# Altium schematic sheet Laser_current_board.SchDoc
size A4
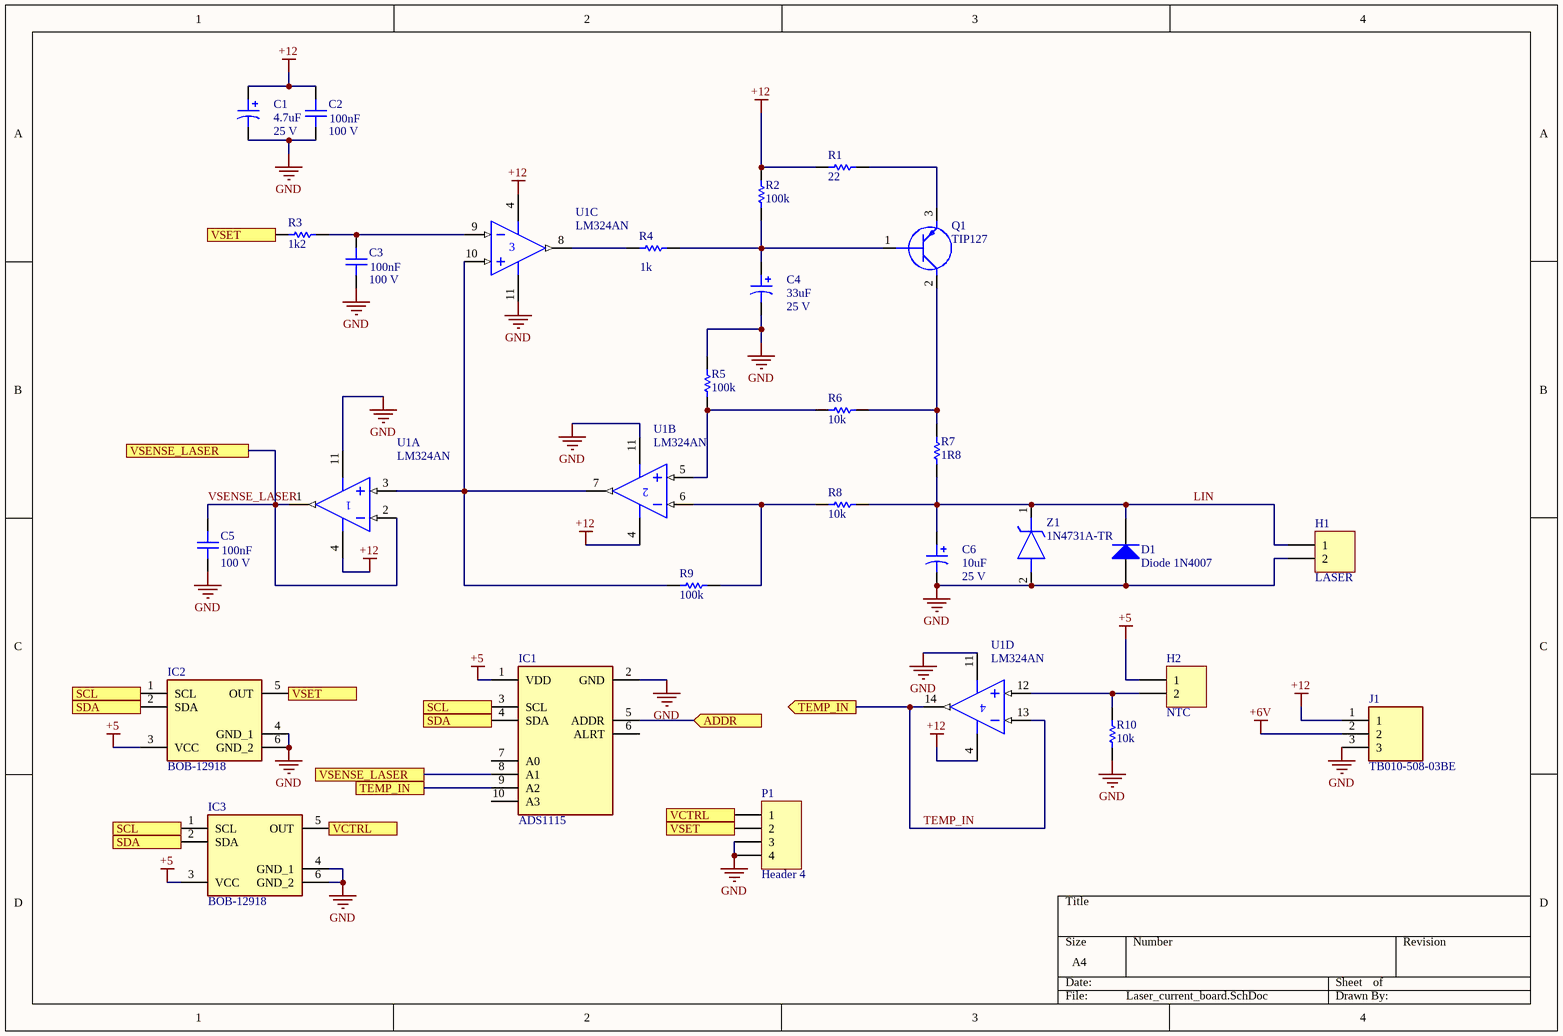
[diagram p0: Laser_current_board.SchDoc]

## Parts
C1  value 4.7uF  Voltage: 25 V  [CP-5.0mm-11.0mm-2.0mm]  (hidden comment: CapacitorPol)
C2  value 100nF  Voltage: 100 V  [C100-200-100]  (hidden comment: Capacitor)
C3  value 100nF  Voltage: 100 V  [C100-200-100]  (hidden comment: Capacitor)
C4  value 33uF  Voltage: 25 V  [CP-5.0mm-11.0mm-2.0mm]  (hidden comment: CapacitorPol)
C5  value 100nF  Voltage: 100 V  [C100-200-100]  (hidden comment: Capacitor)
C6  value 10uF  Voltage: 25 V  [CP-5.0mm-11.0mm-2.0mm]  (hidden comment: CapacitorPol)
D1  Diode 1N4007  [DO-41]
H1  LASER  [TB02]
H2  NTC  [TB02]
IC1  ADS1115  [ADS1115]
IC2  BOB-12918  [BOB12918]
IC3  BOB-12918  [BOB12918]
J1  TB010-508-03BE  [TB01050803BE]
P1  Header 4  [HDR1X4]
Q1  TIP127  [TO254P483X1010X2035-3P]
R1  value 22  [R400-2.0mm]  (hidden comment: Resistor)
R2  value 100k  [R400-2.0mm]  (hidden comment: Resistor)
R3  value 1k2  [R400-2.0mm]  (hidden comment: Resistor)
R4  value 1k  [R400-2.0mm]  (hidden comment: Resistor)
R5  value 100k  [R400-2.0mm]  (hidden comment: Resistor)
R6  value 10k  [R400-2.0mm]  (hidden comment: Resistor)
R7  value 1R8  [R400-2.0mm]  (hidden comment: Resistor)
R8  value 10k  [R400-2.0mm]  (hidden comment: Resistor)
R9  value 100k  [R400-2.0mm]  (hidden comment: Resistor)
R10  value 10k  [R400-2.0mm]  (hidden comment: Resistor)
U1  LM324AN  [N014]  (parts A,B,C,D of 4)
Z1  1N4731A-TR  [DIOAD1310W86L370D235]

## Ports
ADDR (in), SCL, SCL (in), SDA, SDA (in), TEMP_IN, TEMP_IN (out), VCTRL, VSENSE_LASER, VSET

## Nets
+5: H2.1 IC1.1(VDD) IC2.3(VCC) IC3.3(VCC)
+6V: J1.2
+12: C1.1 C2.2 J1.1 R1.1 R2.1 U1.4(V+)
GND: C1.2 C2.1 C3.1 C4.2 C5.1 C6.2 D1.1(A) H1.2 IC1.2(GND) IC2.4(GND_1) IC2.6(GND_2) IC3.4(GND_1) IC3.6(GND_2) J1.3 P1.3 P1.4 R5.2 R10.1 U1.11(V-) Z1.2(A)
ADDR: IC1.5(ADDR) ; port ADDR
LIN: C6.1 D1.2(K) H1.1 R7.2 R8.2 Z1.1(K)
SCL: IC1.3(SCL) IC2.1(SCL) IC3.1(SCL) ; port SCL
SDA: IC1.4(SDA) IC2.2(SDA) IC3.2(SDA) ; port SDA
TEMP_IN: IC1.9(A2) U1.13(IN-) U1.14(OUT) ; port TEMP_IN
VCTRL: IC3.5(OUT) P1.1 ; port VCTRL
VSENSE_LASER: C5.2 IC1.8(A1) U1.1(OUT) U1.2(IN-) ; port VSENSE_LASER
VSET: IC2.5(OUT) P1.2 R3.2 ; port VSET
NetC3_2: C3.2 R3.1 U1.9(IN-)
NetC4_1: C4.1 Q1.1(B) R2.2 R4.1
NetH2_2: H2.2 R10.2 U1.12(IN+)
NetQ1_2: Q1.2(C) R6.2 R7.1
NetQ1_3: Q1.3(E) R1.2
NetR4_2: R4.2 U1.8(OUT)
NetR5_1: R5.1 R6.1 U1.5(IN+)
NetR8_1: R8.1 R9.2 U1.6(IN-)
NetR9_1: R9.1 U1.3(IN+) U1.7(OUT) U1.10(IN+)

Not connected (* = marked no-connect by the designer): IC1 6(ALRT) 7(A0) 10(A3)

## Library data of the parts
C1 C4 C6 = CapacitorPol: Solid Aluminum Capacitor with Organic Semiconductor Electrolyte: 100uF, 10V, Bulk Pack; Note: Part Numbers shown are for ± 20% capacitance tolerance (X0).; PCB_Layout: Complies with Manufacturer's Recommendation.; DrillSize: Nominal, Rounded to the nearest 0.1mm; Published: 19-Mar-2004; DatasheetDocument: 29-Jun-2001; PackageReference: E; Publisher: Altium Limited; ComponentLink1Description: Manufacturer Link; ComponentLink1URL: http://www.vishay.com/; ComponentLink2Description: Datasheet; ComponentLink2URL: http://www.vishay.com/docs/90003/94sa.pdf
D1 = Diode 1N4007: 1 Amp General Purpose Rectifier; Published: 8-Jun-2000; LatestRevisionDate: 17-Jul-2002; LatestRevisionNote: Re-released for DXP Platform.; DatasheetVersion: 1998; PackageVersion: Aug-1999; PackageReference: DO-41; Publisher: Altium Limited; PackageDescription: Diode, Axial; Body 5.2 x 2.7 mm (LxDia. max), Lead Dia. 0.86 mm (max); Code_JEDEC: DO-204-AL; ComponentLink1Description: Manufacturer Link; ComponentLink1URL: http://www.fairchildsemi.com/; ComponentLink2Description: Datasheet; ComponentLink2URL: http://www.fairchildsemi.com/ds/1N%2F1N4001.pdf
H1 H2 = Terminal_1x2: Bloco terminal 1x2
IC1 = ADS1115: Integrated Circuit; Manufacturer_Name: Adafruit; Datasheet Link: https://cdn-learn.adafruit.com/downloads/pdf/adafruit-4-channel-adc-breakouts.pdf; Height: 3.25mm; Manufacturer_Part_Number: ADS1115
IC2 IC3 = BOB-12918: Integrated Circuit; Manufacturer_Name: SparkFun; Datasheet Link: https://www.sparkfun.com/products/12918; Height: 2mm; Manufacturer_Part_Number: BOB-12918; Mouser Part Number: 474-BOB-12918; Mouser Price/Stock: https://www.mouser.co.uk/ProductDetail/SparkFun/BOB-12918?qs=WyAARYrbSnZElsWSnCaKMQ%3D%3D; Arrow Part Number: BOB-12918; Arrow Price/Stock: https://www.arrow.com/en/products/bob-12918/sparkfun-electronics?region=nac
J1 = TB010-508-03BE: Connector; Manufacturer_Name: CUI Inc.; Datasheet Link: https://componentsearchengine.com/Datasheets/1/TB010-508-03BE.pdf; Height: 18.2mm; Manufacturer_Part_Number: TB010-508-03BE; Mouser Part Number: 490-TB010-508-03BE; Mouser Price/Stock: https://www.mouser.co.uk/ProductDetail/CUI-Devices/TB010-508-03BE?qs=vLWxofP3U2z1pw1VuAsf2Q%3D%3D; Arrow Part Number: TB010-508-03BE; Arrow Price/Stock: https://www.arrow.com/en/products/tb010-508-03be/cui-devices?region=nac
P1 = Header 4: Header, 4-Pin; LatestRevisionDate: 17-Jul-2002; LatestRevisionNote: Re-released for DXP Platform.; Publisher: Altium Limited
Q1 = TIP127: Transistor BJT PNP; Manufacturer_Name: onsemi; Datasheet Link: http://www.onsemi.com/pub/Collateral/TIP120-D.PDF; Height: 4.83mm; Manufacturer_Part_Number: TIP127; Mouser Part Number: 512-TIP127; Mouser Price/Stock: https://www.mouser.co.uk/ProductDetail/ON-Semiconductor-Fairchild/TIP127?qs=ljbEvF4DwOMFP7NR%2F8L9Tw%3D%3D; Arrow Part Number: TIP127; Arrow Price/Stock: https://www.arrow.com/en/products/tip127/on-semiconductor
R1-R10 = Resistor: Power: 1/8 W; Tolerance: 5%; Published: 8-Jun-2000; LatestRevisionDate: 17-Jul-2002; LatestRevisionNote: Re-released for DXP Platform.; PackageReference: AXIAL-0.3; Publisher: Altium Limited
U1 = LM324AN: Quadruple Operational Amplifier; Published: 15-Apr-2002; LatestRevisionDate: 04-Mar-2005; LatestRevisionNote: Stylized 3D Model Added.; DatasheetVersion: Jan-1989; PackageVersion: Oct-1995; PackageReference: N014; Publisher: Altium Limited; PackageDescription: DIP; 14 Leads; Row Spacing 7.62 mm; Pitch 2.54 mm; ComponentLink1Description: Manufacturer Link; ComponentLink1URL: http://www.ti.com/; ComponentLink2Description: Datasheet; ComponentLink2URL: http://www-s.ti.com/sc/ds/lm324.pdf
Z1 = 1N4731A-TR: Zener Diode; Manufacturer_Name: Vishay; Datasheet Link: https://datasheet.datasheetarchive.com/originals/distributors/Datasheets-314/271599.pdf; Manufacturer_Part_Number: 1N4731A-TR; Mouser Part Number: 78-1N4731A; Mouser Price/Stock: https://www.mouser.co.uk/ProductDetail/Vishay-Semiconductors/1N4731A-TR?qs=oNDV51lhjEN87sfLnBRrvg%3D%3D; Arrow Part Number: 1N4731A-TR; Arrow Price/Stock: https://www.arrow.com/en/products/1n4731a-tr/vishay
C2 C3 C5 = Capacitor: Published: 8-Jun-2000; LatestRevisionDate: 17-Jul-2002; LatestRevisionNote: Re-released for DXP Platform.; PackageReference: RAD-0.3; Publisher: Altium Limited